# Altium schematic sheet Connector_Sheet.SchDoc
size 420 x 297 mm; SheetNumber: 11; SheetTotal: 11
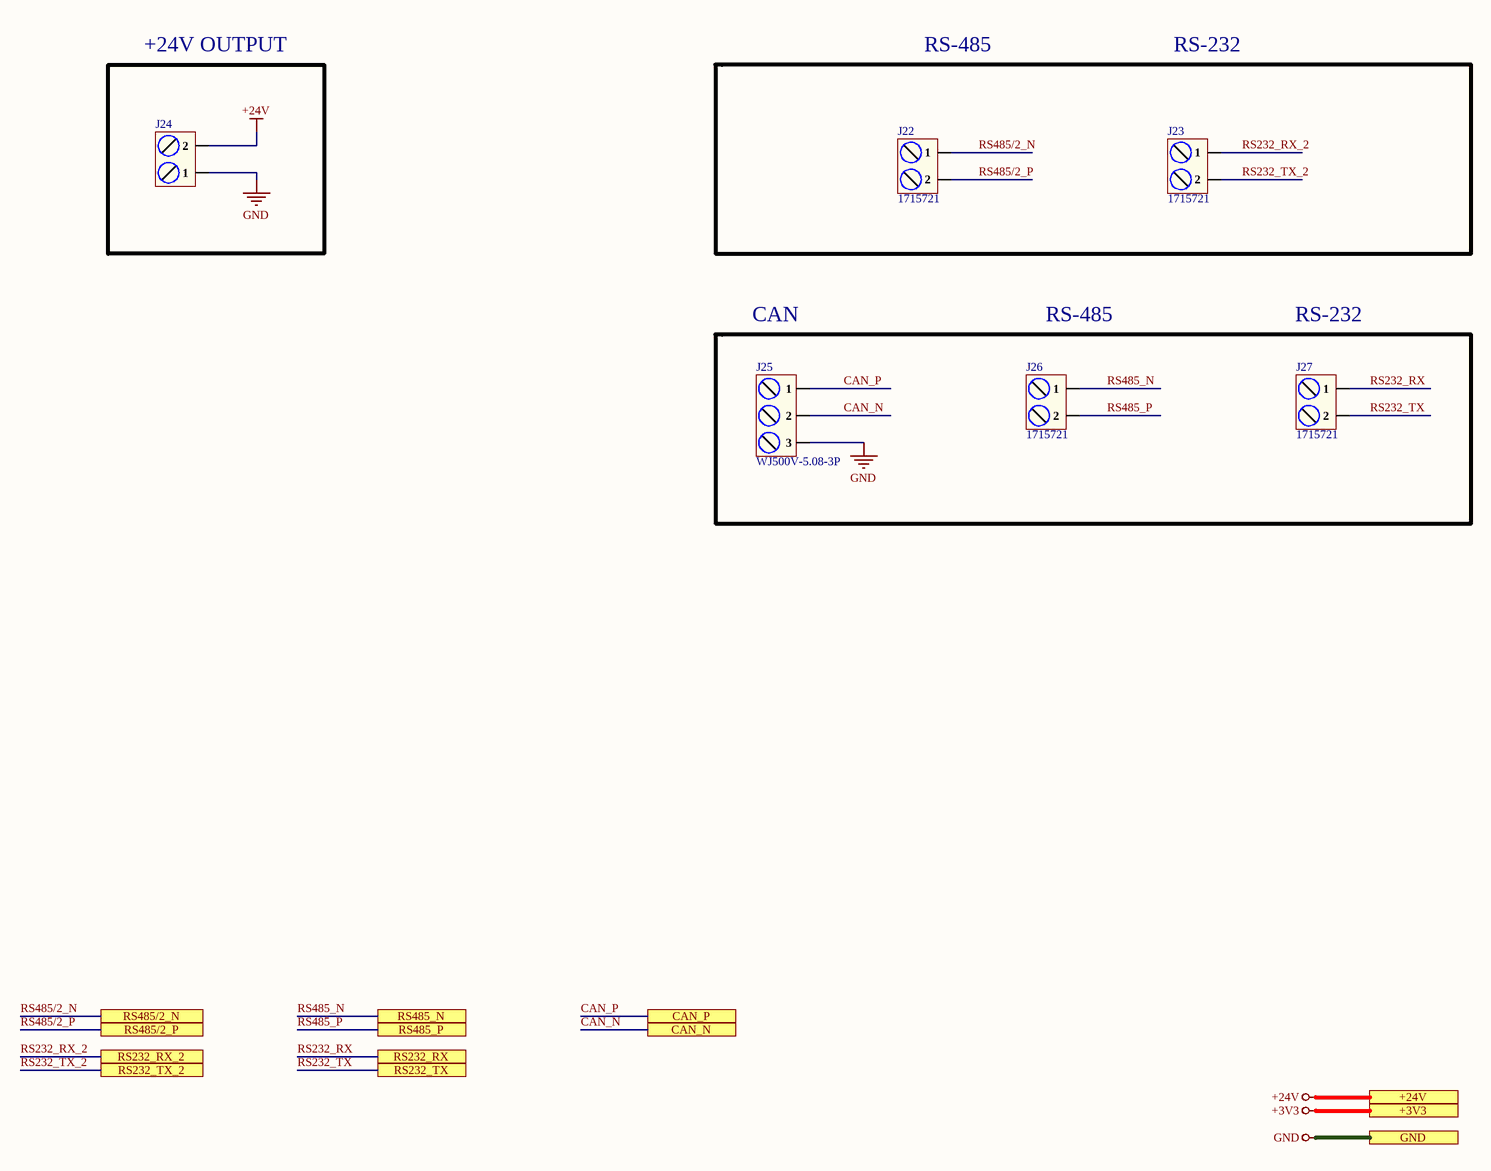
[diagram p0: Connector_Sheet.SchDoc]

## Parts
J22  1715721  [1715721]
J23  1715721  [1715721]
J24  MXHB9500-9.5-02P-BK01-Cu-S-A  [MXHB9500-9.5-02P-BK01-Cu-S-A]  (value not drawn)
J25  WJ500V-5.08-3P  [WJ500V-5.08-3P]
J26  1715721  [1715721]
J27  1715721  [1715721]

## Ports
+3V3 (see Top_Sheet[4B], CAN_Sheet[5D], ESP32_Sheet[5D], EtherCAT_Sheet[5D], Ethernet_Sheet[5D], Power_Sheet[5D], RJ45_Sheet[5D], RS485_RS232_Sheet[5D], STM32_Sheet[5D], TFT_Display_Sheet[5D]), +24V (see Top_Sheet[4B], Power_Sheet[5D]), CAN_N (see Top_Sheet[4B], CAN_Sheet[3D]), CAN_P (see Top_Sheet[4B], CAN_Sheet[3D]), GND (see Top_Sheet[4B], CAN_Sheet[5D], ESP32_Sheet[5D], EtherCAT_Sheet[5D], Ethernet_Sheet[5D], Power_Sheet[5D], RJ45_Sheet[5D], RS485_RS232_Sheet[5D], STM32_Sheet[5D], TFT_Display_Sheet[5D]), RS232_RX (see Top_Sheet[4B], RS485_RS232_Sheet[2D]), RS232_RX_2 (see Top_Sheet[4C], RS485_RS232_Sheet[1D]), RS232_TX (see Top_Sheet[4B], RS485_RS232_Sheet[2D]), RS232_TX_2 (see Top_Sheet[4C], RS485_RS232_Sheet[1D]), RS485/2_N (see Top_Sheet[4C], RS485_RS232_Sheet[1D]), RS485/2_P (see Top_Sheet[4C], RS485_RS232_Sheet[1D]), RS485_N (see Top_Sheet[4B], RS485_RS232_Sheet[2D]), RS485_P (see Top_Sheet[4B], RS485_RS232_Sheet[2D])

## Nets
+3V3: port +3V3
+24V: J24.2 ; port +24V
GND: J24.1 J25.3 ; port GND
CAN_N: J25.2 ; port CAN_N
CAN_P: J25.1 ; port CAN_P
RS232_RX: J27.1 ; port RS232_RX
RS232_RX_2: J23.1 ; port RS232_RX_2
RS232_TX: J27.2 ; port RS232_TX
RS232_TX_2: J23.2 ; port RS232_TX_2
RS485/2_N: J22.1 ; port RS485/2_N
RS485/2_P: J22.2 ; port RS485/2_P
RS485_N: J26.1 ; port RS485_N
RS485_P: J26.2 ; port RS485_P

## Notes on the sheet
- +24V OUTPUT
- RS-485
- RS-232
- CAN
- File:
- Title:
- Date:
- Page
- Num:
- Total:
- Drawn By: Huzaifa Ali

## Library data of the parts
J22 J23 J26 J27 = 1715721: TERM BLK 2P SIDE ENT 5.08MM PCB; Manufacturer: Phoenix Contact; Item Type: Terminal Blocks; Supplier: Digikey; Supplier Part Number: 277-1263-ND; Manufacturer Part Number: 1715721; RoHS: Yes; Stock: 13160; Pricing: 1=0.94 (USD); ComponentLink1URL: https://datasheet.ciiva.com/1120/1697161-1120393.pdf?src-supplier=Farnell; ComponentLink1Description: https://datasheet.ciiva.com/1120/1697161-1120393.pdf?src-supplier=Farnell; ComponentLink2URL: https://datasheet.ciiva.com/832/1715721-832095.pdf?src-supplier=Digikey; ComponentLink2Description: https://datasheet.ciiva.com/832/1715721-832095.pdf?src-supplier=Digikey; ComponentLink3URL: https://datasheet.ciiva.com/15169/getdatasheetpartid-212174-15169929.pdf?src-supplier=Verical; ComponentLink3Description: https://datasheet.ciiva.com/15169/getdatasheetpartid-212174-15169929.pdf?src-supplier=Verical; ComponentLink4URL: https://datasheet.ciiva.com/16046/1715721-16046034.pdf?src-supplier=Onlinecomponents.com; ComponentLink4Description: https://datasheet.ciiva.com/16046/1715721-16046034.pdf?src-supplier=Onlinecomponents.com
J24 = MXHB9500-9.5-02P-BK01-Cu-S-A: Tin 1x2P Corner pin Three sides 2 1 9.5mm -40℃~+105℃ 20A 300V Black 10~22 Copper Alloy 0.5~4 Plugin,P=9.5mm Barrier Terminal Blocks ROHS; Manufacturer: MAX; Manufacturer Part Number: MXHB9500-9.5-02P-BK01-Cu-S-A; Package: Plugin,P=9.5mm; LCSC Part Number: C7542168; Item Type: Terminal Block; ComponentLink1Description: LCSC; ComponentLink1URL: https://www.lcsc.com/product-detail/Barrier-Terminal-Blocks_MAX-MXHB9500-9-5-02P-BK01-Cu-S-A_C7542168.html
J25 = WJ500V-5.08-3P: 1x3P 18A -40℃~+105℃ 250V Green 14~30 Straight pin 5.08mm 2.5 1 3 Plugin,P=5.08mm Screw terminal ROHS; Manufacturer: Ningbo Kangnex Elec; Item Type: Terminal Block; Manufacturer Part Number: WJ500V-5.08-3P; Package: Plugin,P=5.08mm; LCSC Part Number: C72334; ComponentLink1Description: LCSC; ComponentLink1URL: https://www.lcsc.com/product-detail/Screw-terminal_Ningbo-Kangnex-Elec-WJ500V-5-08-3P_C72334.html